# Altium schematic sheet 19.RK3568_Audio Interface.SchDoc
size 297 x 209 mm
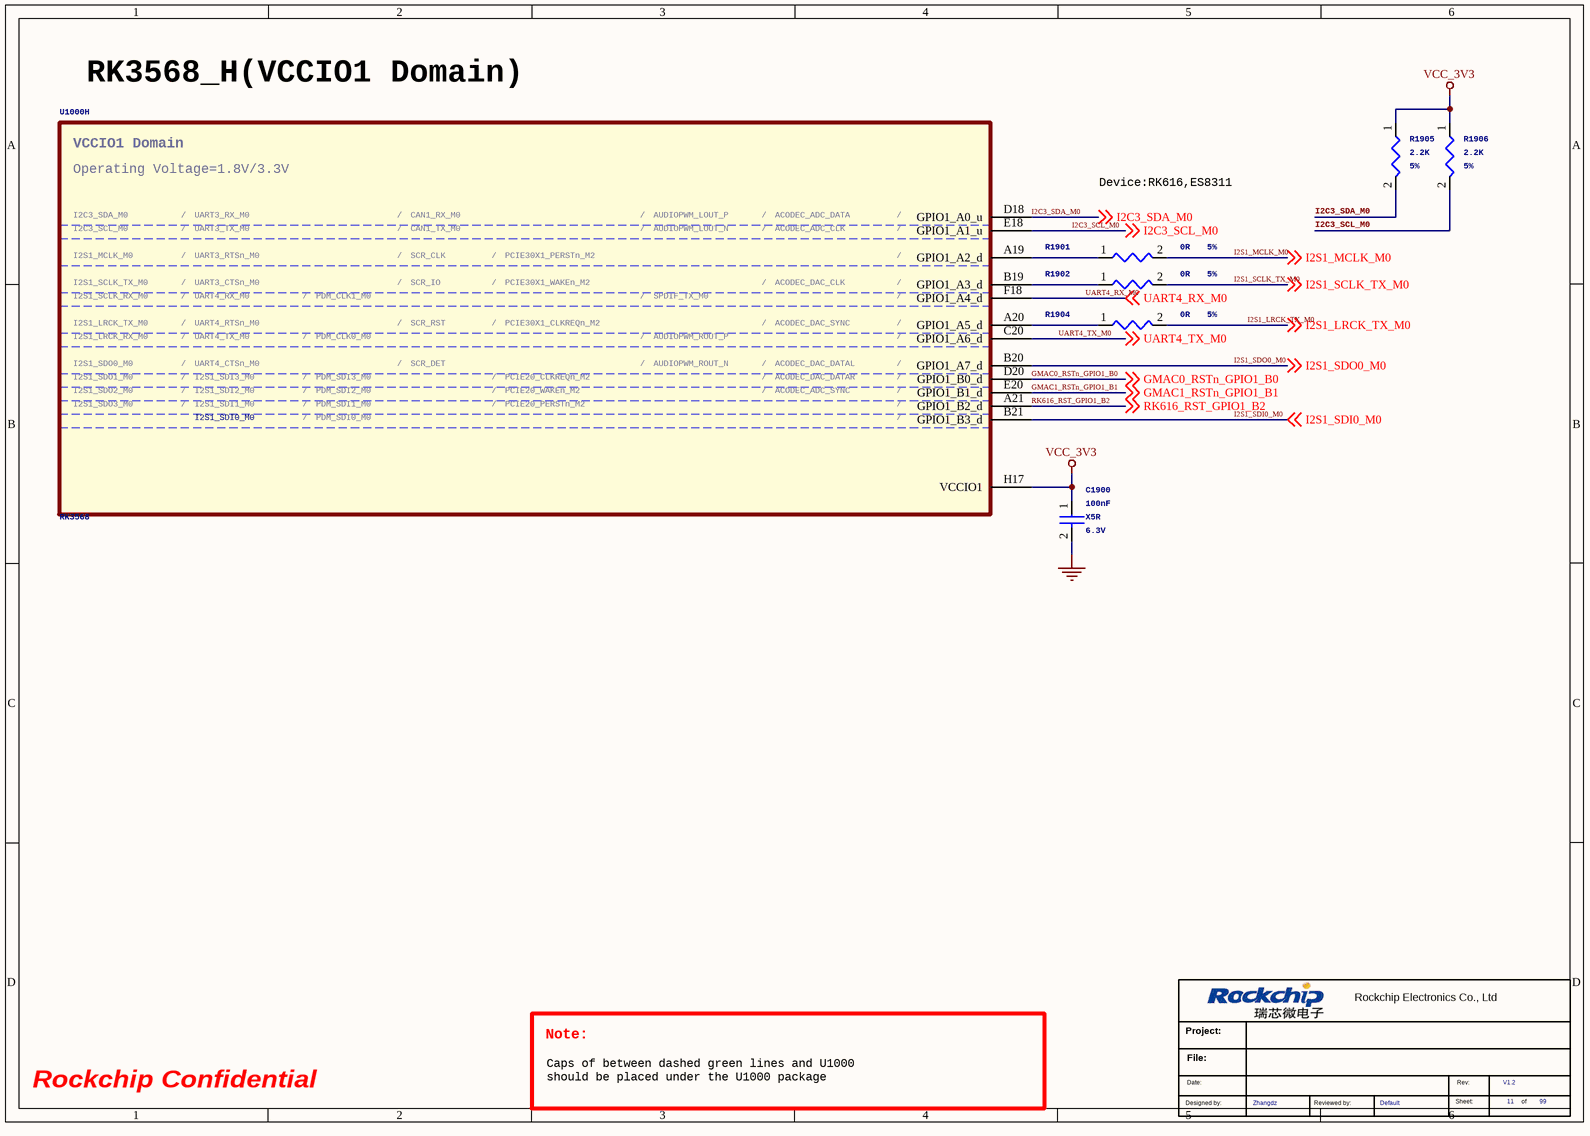
[diagram p0: 19.RK3568_Audio Interface.SchDoc]

## Parts
*  Schematic Page Count: 99  Schematic Page Number: 11  Designer: Zhangdz  Revision: V1.2  Check: Default  (hidden comment: Rockchip_new)  (graphical)
C1900  100nF  Voltage: 6.3V  Dielectric: X5R  [C0201]
R1901  0R  Tolerance: 5%  [R0402]
R1902  0R  Tolerance: 5%  [R0402]
R1904  0R  Tolerance: 5%  [R0402]
R1905  2.2K  Tolerance: 5%  [R0402]
R1906  2.2K  Tolerance: 5%  [R0402]
U1000  RK3568  [BGA636_19R00X19R00X1R20]  (part H of 23)

## Nets
GND: C1900.2
VCC_3V3: C1900.1 R1905.1 R1906.1 U1000.H17(VCCIO1)
GMAC0_RSTn_GPIO1_B0: U1000.D20(GPIO1_B0_d) ; off-sheet GMAC0_RSTn_GPIO1_B0
GMAC1_RSTn_GPIO1_B1: U1000.E20(GPIO1_B1_d) ; off-sheet GMAC1_RSTn_GPIO1_B1
I2C3_SCL_M0: R1906.2 U1000.E18(GPIO1_A1_u) ; off-sheet I2C3_SCL_M0
I2C3_SDA_M0: R1905.2 U1000.D18(GPIO1_A0_u) ; off-sheet I2C3_SDA_M0
I2S1_LRCK_TX_M0: R1904.2 ; off-sheet I2S1_LRCK_TX_M0
I2S1_MCLK_M0: R1901.2 ; off-sheet I2S1_MCLK_M0
I2S1_SCLK_TX_M0: R1902.2 ; off-sheet I2S1_SCLK_TX_M0
I2S1_SDI0_M0: U1000.B21(GPIO1_B3_d) ; off-sheet I2S1_SDI0_M0
I2S1_SDO0_M0: U1000.B20(GPIO1_A7_d) ; off-sheet I2S1_SDO0_M0
RK616_RST_GPIO1_B2: U1000.A21(GPIO1_B2_d) ; off-sheet RK616_RST_GPIO1_B2
UART4_RX_M0: U1000.F18(GPIO1_A4_d) ; off-sheet UART4_RX_M0
UART4_TX_M0: U1000.C20(GPIO1_A6_d) ; off-sheet UART4_TX_M0
NetR1901_1: R1901.1 U1000.A19(GPIO1_A2_d)
NetR1902_1: R1902.1 U1000.B19(GPIO1_A3_d)
NetR1904_1: R1904.1 U1000.A20(GPIO1_A5_d)

## Notes on the sheet
- RK3568_H(VCCIO1 Domain)
- Device:RK616,ES8311
- Note:
- Rockchip Confidential
- Caps of between dashed green lines and U1000
  should be placed under the U1000 package
- (in symbol Rockchip_new) Rockchip Electronics Co., Ltd; Project:; File:; Date:; Rev:; Designed by:; Reviewed by:; Sheet:; of
- (in symbol SOC_RK3568, part H) VCCIO1 Domain; Operating Voltage=1.8V/3.3V; I2C3_SDA_M0; /; UART3_RX_M0; CAN1_RX_M0; AUDIOPWM_LOUT_P; ACODEC_ADC_DATA; I2C3_SCL_M0; UART3_TX_M0; CAN1_TX_M0; AUDIOPWM_LOUT_N; ACODEC_ADC_CLK; I2S1_MCLK_M0; UART3_RTSn_M0; SCR_CLK; PCIE30X1_PERSTn_M2; I2S1_SCLK_TX_M0; UART3_CTSn_M0; SCR_IO; PCIE30X1_WAKEn_M2; ACODEC_DAC_CLK; I2S1_SCLK_RX_M0; UART4_RX_M0; PDM_CLK1_M0; SPDIF_TX_M0; I2S1_LRCK_TX_M0; UART4_RTSn_M0; SCR_RST; PCIE30X1_CLKREQn_M2; ACODEC_DAC_SYNC; I2S1_LRCK_RX_M0; UART4_TX_M0; PDM_CLK0_M0; AUDIOPWM_ROUT_P; I2S1_SDO0_M0; UART4_CTSn_M0; SCR_DET; AUDIOPWM_ROUT_N; ACODEC_DAC_DATAL; I2S1_SDO1_M0; I2S1_SDI3_M0; PDM_SDI3_M0; PCIE20_CLKREQn_M2; ACODEC_DAC_DATAR; I2S1_SDO2_M0; I2S1_SDI2_M0; PDM_SDI2_M0; PCIE20_WAKEn_M2; ACODEC_ADC_SYNC; I2S1_SDO3_M0; I2S1_SDI1_M0; PDM_SDI1_M0; PCIE20_PERSTn_M2; I2S1_SDI0_M0; PDM_SDI0_M0

## Library data of the parts
* = Rockchip_new: Page Number: 16; Page Count: 37; Revcode: V1.2
C1900 = CAP NP: cap,100.00nF,+/-10%,6.3V,X5R,C0201; Manufacturer: TDK; RK PN: C0603X5R0J104K030BC; Priority: A; Tolerance: 10%; Part Type: C0201; Manufacturer PN: C0603X5R0J104K030BC; Created by: JJJ
R1901 = RESISTOR: 通用厚膜电阻,0R,+/-5%,R0402,1/16W.; Manufacturer PN: RC0402JR-070RL; Manufacturer: YAGEO; Wattage: 1/16W; Priority: A; Created by: YTL; Part Type: 通用厚膜电阻; RK PN: RC0402JR-070RL
R1902 R1904 = RESISTOR: 通用厚膜电阻,0R,+/-5%,R0402,1/16W.; Manufacturer: YAGEO; RK PN: RC0402JR-070RL; Priority: A; Wattage: 1/16W; Part Type: 通用厚膜电阻; Manufacturer PN: RC0402JR-070RL; Created by: YTL
R1905 R1906 = RESISTOR: 通用厚膜电阻,2K2,+/-5%,R0402,1/16W.; Manufacturer: YAGEO; RK PN: RC0402JR-072K2L; Priority: A; Wattage: 1/16W; Part Type: 通用厚膜电阻; Manufacturer PN: RC0402JR-072K2L; Created by: YTL
U1000 = SOC_RK3568: ROCKCHIP SOC; Manufacturer: Rockchip (瑞芯微); SPLIT_INST: TRUE; SWAP_INFO: (S1+S2+S3+S4+S5+S6+S7+S8+S9+S10+S11+S12+S13+S14+S15+S16+S17+S18+S19+S20+S21+S22+S23); Priority: A; Created by: JJJ; Manufacturer PN: RK3568; Part Type: SOC; RK PN: RK3568